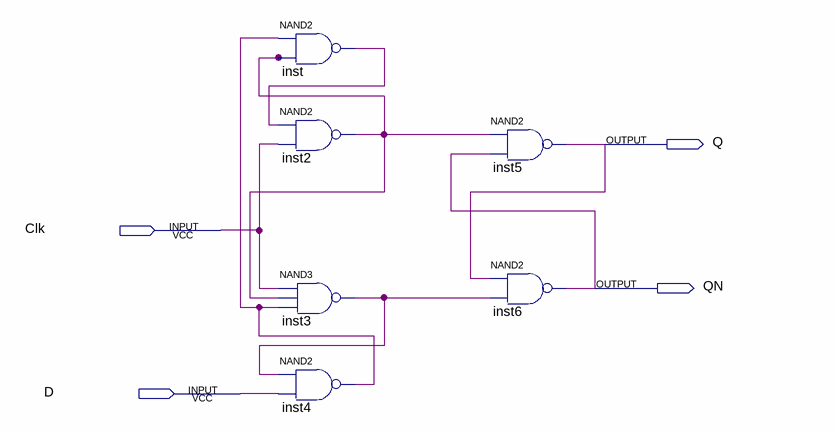
[diagram p0: schematic sheet]
// Quartus schematic lab9step3b.bdf as structural Verilog: 6 symbols, 4 pins
module lab9step3b (
  input  Clk,
  input  D,
  output Q,
  output QN
);

  wire inst2_out, inst3_out, inst4_out, inst_out;

  nand inst (inst_out, inst4_out, inst2_out);
  nand inst2 (inst2_out, inst_out, Clk);
  nand inst3 (inst3_out, Clk, inst2_out, inst4_out);
  nand inst4 (inst4_out, inst3_out, D);
  nand inst5 (Q, inst2_out, QN);
  nand inst6 (QN, Q, inst3_out);
endmodule
